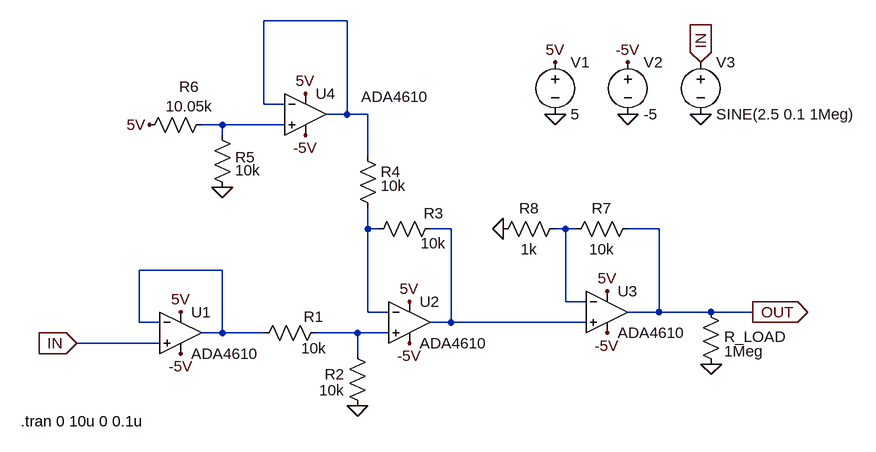
[diagram p0: schematic Fluxus.asc]
Fluxus.asc, the LTspice schematic file:
Version 4
SHEET 1 1168 680
WIRE 368 -304 240 -304
WIRE 240 -176 240 -304
WIRE 272 -176 240 -176
WIRE 368 -160 368 -304
WIRE 368 -160 336 -160
WIRE 400 -160 368 -160
WIRE 176 -144 144 -144
WIRE 272 -144 176 -144
WIRE 176 -128 176 -144
WIRE 400 -96 400 -160
WIRE 400 16 400 -16
WIRE 416 16 400 16
WIRE 528 16 496 16
WIRE 704 16 688 16
WIRE 720 16 704 16
WIRE 848 16 800 16
WIRE 176 80 48 80
WIRE 704 128 704 16
WIRE 736 128 704 128
WIRE 400 144 400 16
WIRE 432 144 400 144
WIRE 848 144 848 16
WIRE 848 144 800 144
WIRE 928 144 848 144
WIRE 992 144 928 144
WIRE 48 160 48 80
WIRE 80 160 48 160
WIRE 528 160 528 16
WIRE 528 160 496 160
WIRE 736 160 528 160
WIRE 176 176 176 80
WIRE 176 176 144 176
WIRE 240 176 176 176
WIRE 384 176 320 176
WIRE 432 176 384 176
WIRE 80 192 -48 192
WIRE 384 208 384 176
FLAG 384 288 0
FLAG 176 -48 0
FLAG 608 16 0
FLAG 992 144 OUT
IOPIN 992 144 Out
FLAG -48 192 IN
IOPIN -48 192 In
FLAG 688 -160 0
FLAG 800 -160 0
FLAG 912 -160 0
FLAG 912 -240 IN
IOPIN 912 -240 In
FLAG 688 -240 5V
FLAG 800 -240 -5V
FLAG 304 -192 5V
FLAG 112 144 5V
FLAG 464 128 5V
FLAG 768 112 5V
FLAG 304 -128 -5V
FLAG 112 208 -5V
FLAG 464 192 -5V
FLAG 768 176 -5V
FLAG 64 -144 5V
FLAG 928 224 0
SYMBOL Opamps\\ADA4610 112 112 R0
SYMATTR InstName U1
SYMBOL Opamps\\ADA4610 464 96 R0
SYMATTR InstName U2
SYMBOL Opamps\\ADA4610 768 80 R0
SYMATTR InstName U3
SYMBOL Opamps\\ADA4610 304 -224 R0
WINDOW 3 86 37 Left 2
SYMATTR InstName U4
SYMBOL res 336 160 R90
WINDOW 0 7 19 VBottom 2
WINDOW 3 24 19 VTop 2
SYMATTR InstName R1
SYMATTR Value 10k
SYMBOL res 400 304 R180
WINDOW 0 36 64 Left 2
WINDOW 3 36 40 Left 2
SYMATTR InstName R2
SYMATTR Value 10k
SYMBOL res 512 0 R90
WINDOW 0 8 11 VBottom 2
WINDOW 3 23 11 VTop 2
SYMATTR InstName R3
SYMATTR Value 10k
SYMBOL res 384 -112 R0
WINDOW 3 36 62 Left 2
SYMATTR InstName R4
SYMATTR Value 10k
SYMBOL res 160 -144 R0
WINDOW 0 36 50 Left 2
WINDOW 3 36 70 Left 2
SYMATTR InstName R5
SYMATTR Value 10k
SYMBOL res 160 -160 R90
WINDOW 0 -27 35 VBottom 2
WINDOW 3 -28 35 VTop 2
SYMATTR InstName R6
SYMATTR Value 10.05k
SYMBOL res 816 0 R90
WINDOW 0 0 56 VBottom 2
WINDOW 3 32 56 VTop 2
SYMATTR InstName R7
SYMATTR Value 10k
SYMBOL res 704 0 R90
WINDOW 0 0 56 VBottom 2
WINDOW 3 32 56 VTop 2
SYMATTR InstName R8
SYMATTR Value 1k
SYMBOL voltage 688 -256 R0
WINDOW 123 0 0 Left 0
WINDOW 39 0 0 Left 0
SYMATTR InstName V1
SYMATTR Value 5
SYMBOL voltage 800 -256 R0
WINDOW 123 0 0 Left 0
WINDOW 39 0 0 Left 0
SYMATTR InstName V2
SYMATTR Value -5
SYMBOL voltage 912 -256 R0
WINDOW 123 0 0 Left 0
WINDOW 39 0 0 Left 0
SYMATTR InstName V3
SYMATTR Value SINE(2.5 0.1 1Meg)
SYMBOL res 912 128 R0
WINDOW 0 36 54 Left 2
SYMATTR InstName R_LOAD
SYMATTR Value 1Meg
TEXT -134 312 Left 2 !.tran 0 10u 0 0.1u

The netlist it stands for:
* Fluxus.asc
XU1 IN N006 5V -5V N006 ADA4610  ; pins In+ In- V+ V- OUT
XU2 N007 N003 5V -5V N004 ADA4610  ; pins In+ In- V+ V- OUT
XU3 N004 N005 5V -5V OUT ADA4610  ; pins In+ In- V+ V- OUT
XU4 N002 N001 5V -5V N001 ADA4610  ; pins In+ In- V+ V- OUT
R1 N007 N006 10k
R2 0 N007 10k
R3 N004 N003 10k
R4 N001 N003 10k
R5 N002 0 10k
R6 N002 5V 10.05k
R7 OUT N005 10k
R8 N005 0 1k
V1 5V 0 5
V2 -5V 0 -5
V3 IN 0 SINE(2.5 0.1 1Meg)
R_LOAD OUT 0 1Meg
.tran 0 10u 0 0.1u
.backanno
.end